# EAGLE design ECG_and_EMG_V2 (EAGLE 9.5.1)
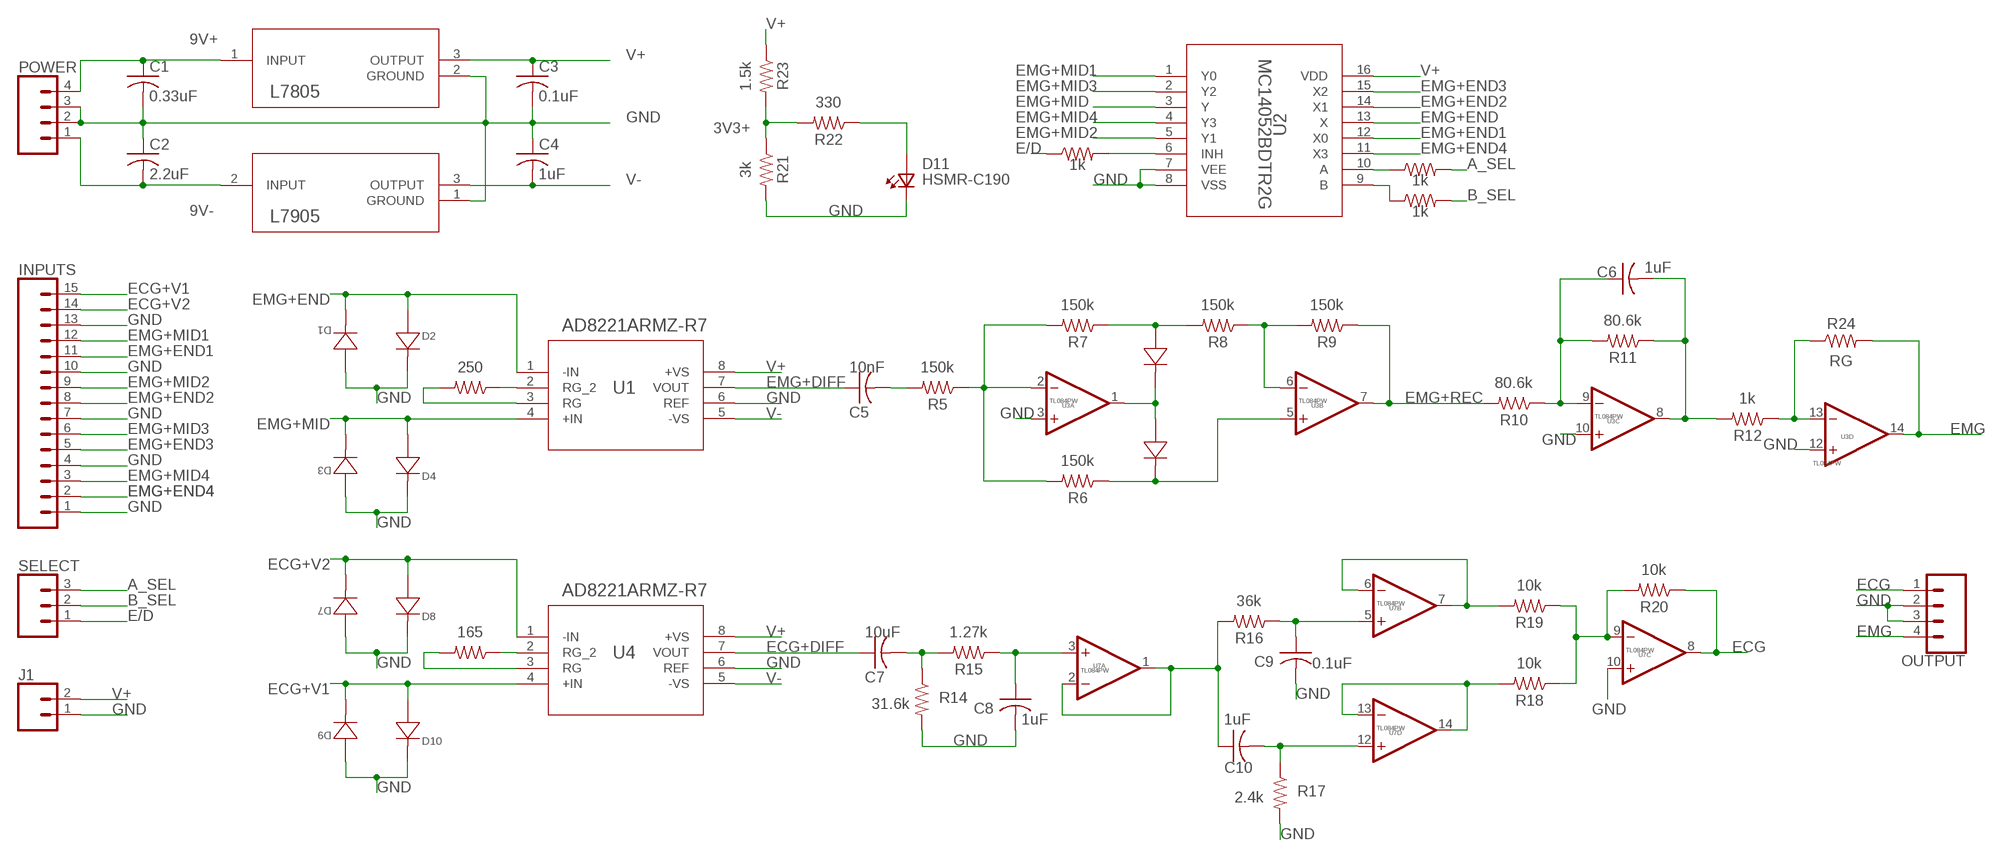
[diagram p0: schematic, sheet 1]

## Parts
C1  0.33uF  C-US_CHIP-0805(2012-METRIC)  [CAPC2012X110]
C2  2.2uF  C-US_CHIP-0805(2012-METRIC)  [CAPC2012X110]
C3  0.1uF  C-US_CHIP-0805(2012-METRIC)  [CAPC2012X110]
C4  1uF  C-US_CHIP-0805(2012-METRIC)  [CAPC2012X110]
C5  10nF  C-US_CHIP-0805(2012-METRIC)  [CAPC2012X110]
C6  1uF  C-US_CHIP-0805(2012-METRIC)  [CAPC2012X110]
C7  10uF  C-US_CHIP-0805(2012-METRIC)  [CAPC2012X110]
C8  1uF  C-US_CHIP-0805(2012-METRIC)  [CAPC2012X110]
C9  0.1uF  C-US_CHIP-0805(2012-METRIC)  [CAPC2012X110]
C10  1uF  C-US_CHIP-0805(2012-METRIC)  [CAPC2012X110]
D1  1N4148W-V-GS08SOD123_VIS-L  [SOD123_VIS-L]
D2  1N4148W-V-GS08SOD123_VIS-L  [SOD123_VIS-L]
D3  1N4148W-V-GS08SOD123_VIS-L  [SOD123_VIS-L]
D4  1N4148W-V-GS08SOD123_VIS-L  [SOD123_VIS-L]
D5  1N4148W-V-GS08SOD123_VIS-L  [SOD123_VIS-L]
D6  1N4148W-V-GS08SOD123_VIS-L  [SOD123_VIS-L]
D7  1N4148W-V-GS08SOD123_VIS-L  [SOD123_VIS-L]
D8  1N4148W-V-GS08SOD123_VIS-L  [SOD123_VIS-L]
D9  1N4148W-V-GS08SOD123_VIS-L  [SOD123_VIS-L]
D10  1N4148W-V-GS08SOD123_VIS-L  [SOD123_VIS-L]
D11  HSMR-C190  [0603]
INPUTS  CONN_15  [1X15]
J1  CONN_02  [1X02]
L7805  L7805CD2T-TRD2PAK_STM-M  [D2PAK_STM-M]
L7905  L7905ACD2T-TRD2PAK_STM-M  [D2PAK_STM-M]
OUTPUT  CONN_04  [1X04]
POWER  CONN_04  [1X04]
R1  1k  R-US_CHIP-0805(2012-METRIC)  [RESC2012X65]
R2  1k  R-US_CHIP-0805(2012-METRIC)  [RESC2012X65]
R3  1k  R-US_CHIP-0805(2012-METRIC)  [RESC2012X65]
R4  250  R-US_CHIP-0805(2012-METRIC)  [RESC2012X65]
R5  150k  R-US_CHIP-0805(2012-METRIC)  [RESC2012X65]
R6  150k  R-US_CHIP-0805(2012-METRIC)  [RESC2012X65]
R7  150k  R-US_CHIP-0805(2012-METRIC)  [RESC2012X65]
R8  150k  R-US_CHIP-0805(2012-METRIC)  [RESC2012X65]
R9  150k  R-US_CHIP-0805(2012-METRIC)  [RESC2012X65]
R10  80.6k  R-US_CHIP-0805(2012-METRIC)  [RESC2012X65]
R11  80.6k  R-US_CHIP-0805(2012-METRIC)  [RESC2012X65]
R12  1k  R-US_CHIP-0805(2012-METRIC)  [RESC2012X65]
R13  165  R-US_CHIP-0805(2012-METRIC)  [RESC2012X65]
R14  31.6k  R-US_CHIP-0805(2012-METRIC)  [RESC2012X65]
R15  1.27k  R-US_CHIP-0805(2012-METRIC)  [RESC2012X65]
R16  36k  R-US_CHIP-0805(2012-METRIC)  [RESC2012X65]
R17  2.4k  R-US_CHIP-0805(2012-METRIC)  [RESC2012X65]
R18  10k  R-US_CHIP-0805(2012-METRIC)  [RESC2012X65]
R19  10k  R-US_CHIP-0805(2012-METRIC)  [RESC2012X65]
R20  10k  R-US_CHIP-0805(2012-METRIC)  [RESC2012X65]
R21  3k  R-US_CHIP-0805(2012-METRIC)  [RESC2012X65]
R22  330  R-US_CHIP-0805(2012-METRIC)  [RESC2012X65]
R23  1.5k  R-US_CHIP-0805(2012-METRIC)  [RESC2012X65]
R24  RG  R-US_CHIP-0805(2012-METRIC)  [RESC2012X65]
SELECT  CONN_03  [1X03]
U1  AD8221ARMZ-R7  [RM_8_ADI]
U2  MC14052BDTR2G  [TSSOP-16_ONS]
U3  TL084PW  [TSSOP14]
U4  AD8221ARMZ-R7  [RM_8_ADI]
U7  TL084PW  [TSSOP14]

## Nets
3V3+ [Supply]: R21.1 R22.2 R23.2
9V+ [Supply]: C1.1 L7805.1(INPUT) POWER.4
9V- [Supply]: C2.2 L7905.2(INPUT) POWER.1
A_SEL: R2.2 SELECT.3
B_SEL: R3.2 SELECT.2
E/D: R1.1 SELECT.1
ECG: OUTPUT.1 R20.1 U7.8(C:OUT)
ECG+DIFF: C7.1 U4.7(VOUT)
ECG+V1: D9.1 D10.2 INPUTS.15 U4.4(+IN)
ECG+V2: D7.1 D8.2 INPUTS.14 U4.1(-IN)
EMG: OUTPUT.4 R24.2 U3.14(D:OUT)
EMG+DIFF: C5.1 U1.7(VOUT)
EMG+END: D1.1 D2.2 U1.1(-IN) U2.13(X)
EMG+END1: INPUTS.11 U2.12(X0)
EMG+END2: INPUTS.8 U2.14(X1)
EMG+END3: INPUTS.5 U2.15(X2)
EMG+END4: INPUTS.2 U2.11(X3)
EMG+MID: D3.1 D4.2 U1.4(+IN) U2.3(Y)
EMG+MID1: INPUTS.12 U2.1(Y0)
EMG+MID2: INPUTS.9 U2.5(Y1)
EMG+MID3: INPUTS.6 U2.2(Y2)
EMG+MID4: INPUTS.3 U2.4(Y3)
EMG+REC: R9.1 R10.2 U3.7(B:OUT)
GND [Supply]: C1.2 C2.1 C3.2 C4.1 C8.2 C9.2 D1.2 D2.1 D3.2 D4.1 D7.2 D8.1 D9.2 D10.1 D11.1(K2) INPUTS.1 INPUTS.4 INPUTS.7 INPUTS.10 INPUTS.13 J1.1 L7805.2(GROUND) L7905.1(GROUND) OUTPUT.2 OUTPUT.3 POWER.2 POWER.3 R14.2 R17.2 R21.2 U1.6(REF) U2.7(VEE) U2.8(VSS) U3.3(A:+IN) U3.10(C:+IN) U3.12(D:+IN) U4.6(REF) U7.10(C:+IN)
N$1: R1.2 U2.6(INH)
N$2: R2.1 U2.10(A)
N$3: R3.1 U2.9(B)
N$4: R4.1 U1.2(RG_2)
N$5: R4.2 U1.3(RG)
N$6: C5.2 R5.2
N$7: R5.1 R6.2 R7.2 U3.2(A:-IN)
N$8: D6.1 R6.1 U3.5(B:+IN)
N$9: D5.1 D6.2 U3.1(A:OUT)
N$10: D5.2 R7.1 R8.2
N$11: R8.1 R9.2 U3.6(B:-IN)
N$12: C6.1 R10.1 R11.2 U3.9(C:-IN)
N$13: C6.2 R11.1 R12.2 U3.8(C:OUT)
N$15: R13.1 U4.2(RG_2)
N$16: R12.1 R24.1 U3.13(D:-IN)
N$17: R13.2 U4.3(RG)
N$20: C7.2 R14.1 R15.2
N$21: C8.1 R15.1 U7.3(A:+IN)
N$22: C10.1 R16.2 U7.1(A:OUT) U7.2(A:-IN)
N$23: C9.1 R16.1 U7.5(B:+IN)
N$24: C10.2 R17.1 U7.12(D:+IN)
N$25: R18.2 U7.13(D:-IN) U7.14(D:OUT)
N$26: R19.2 U7.6(B:-IN) U7.7(B:OUT)
N$27: R18.1 R19.1 R20.2 U7.9(C:-IN)
N$28: D11.2(A2) R22.1
V+ [Supply]: C3.1 J1.2 L7805.3(OUTPUT) R23.1 U1.8(+VS) U2.16(VDD) U4.8(+VS)
V- [Supply]: C4.2 L7905.3(OUTPUT) U1.5(-VS) U4.5(-VS)

## Power pins joined to a net without a drawn wire
V+: U3.4(P:V+) U7.4(P:V+)
V-: U3.11(P:V-) U7.11(P:V-)

## Library data of the parts
C1-C10 = Capacitor:C-US: Capacitor - ANSI; CATEGORY: Capacitor
D1-D10 = 1N4148W (SOD123):1N4148W-V-GS08; BUILT_BY: EMA_UL_Team; MANUFACTURER_PART_NUMBER: 1N4148W-V-GS08; SOURCELIBRARY: Vishay_2020-02-10; VENDOR: Vishay
D11 = HSMR-C190:HSMR-C190: http://octopart.com/hsmr-c190-avago-672386; AVAILABILITY: Unavailable; DESCRIPTION: Blue 473nm LED Indication - Discrete 3.4V 0603 (1608 Metric); MF: Broadcom Limited; MP: HSMR-C190; PACKAGE: 0603 Broadcom; PRICE: None
INPUTS = SparkFun-Connectors:CONN_15: Multi connection point. Often used as Generic Header-pin footprint for 0.1 inch spaced/style header connections On any of the 0.1 inch spaced packages, you can populate with these: Break Away Headers - Straight <https://www.sparkfun.com/products/116> (PRT-00116) Break Away Male Headers - Right Angle <https://www.sparkfun.com/products/553> (PRT-00553) Female Headers <https://www.sparkfun.com/products/115> (PRT-00115) Break Away Headers - Machine Pin <https://www.sparkfun.com/products/117> (PRT-00117) Break Away Female Headers - Swiss Machine Pin <https://www.sparkfun.com/products/743> (PRT-00743) For SCREWTERMINALS and SPRING TERMINALS visit here: Screw Terimnals on SparkFun.com <https://www.sparkfun.com/search/results?term=Screw+Terminals> (5mm/3.5mm/2.54mm spacing) This device is also useful as a general connection point to wire up your design to another part of your project. Our various solder wires solder well into these plated through hole pads. Hook-Up Wire - Assortment (Stranded, 22 AWG) <https://www.sparkfun.com/products/11375> (PRT-11375) Hook-Up Wire - Assortment (Solid Core, 22 AWG) <https://www.sparkfun.com/products/11367> (PRT-11367) View the entire wire category on our website here <https://www.sparkfun.com/categories/141> Special notes: Molex polarized connector foot print use with SKU : PRT-08231 with associated crimp pins and housings. 1MM SMD Version SKU: PRT-10208 NOTES ON THE VARIANTS LOCK and LOCK_LONGPADS... This footprint was designed to help hold the alignment of a through-hole component (i.e. 6-pin header) while soldering it into place. You may notice that each hole has been shifted either up or down by 0.005 of an inch from it's more standard position (which is a perfectly straight line). This slight alteration caused the pins (the squares in the middle) to touch the edges of the holes. Because they are alternating, it causes a "brace" to hold the component in place. 0.005 has proven to be the perfect amount of "off-center" position when using our standard breakaway headers. Although looks a little odd when you look at the bare footprint, once you have a header in there, the alteration is very hard to notice. Also,if you push a header all the way into place, it is covered up entirely on the bottom side.
J1 = SparkFun-Connectors:CONN_02: Multi connection point. Often used as Generic Header-pin footprint for 0.1 inch spaced/style header connections On any of the 0.1 inch spaced packages, you can populate with these: Break Away Headers - Straight <https://www.sparkfun.com/products/116> (PRT-00116) Break Away Male Headers - Right Angle <https://www.sparkfun.com/products/553> (PRT-00553) Female Headers <https://www.sparkfun.com/products/115> (PRT-00115) Break Away Headers - Machine Pin <https://www.sparkfun.com/products/117> (PRT-00117) Break Away Female Headers - Swiss Machine Pin <https://www.sparkfun.com/products/743> (PRT-00743) For SCREWTERMINALS and SPRING TERMINALS visit here: Screw Terimnals on SparkFun.com <https://www.sparkfun.com/search/results?term=Screw+Terminals> (5mm/3.5mm/2.54mm spacing) This device is also useful as a general connection point to wire up your design to another part of your project. Our various solder wires solder well into these plated through hole pads. Hook-Up Wire - Assortment (Stranded, 22 AWG) <https://www.sparkfun.com/products/11375> (PRT-11375) Hook-Up Wire - Assortment (Solid Core, 22 AWG) <https://www.sparkfun.com/products/11367> (PRT-11367) View the entire wire category on our website here <https://www.sparkfun.com/categories/141> Special notes: Molex polarized connector foot print use with: PRT-08233 with associated crimp pins and housings. 2.54_SCREWTERM for use with PRT-10571. 3.5mm Screw Terminal footprints for PRT-08084 5mm Screw Terminal footprints for use with PRT-08432
L7805 = L7805 (D2PAK):L7805CD2T-TR; BUILT_BY: EMA_UL_Team; MANUFACTURER_PART_NUMBER: L7805CD2T-TR; SOURCELIBRARY: StMicro_2011-06-07; VENDOR: STMicroelectronics
L7905 = L7905 (D2PAK):L7905ACD2T-TR; BUILT_BY: EMA_UL_Team; MANUFACTURER_PART_NUMBER: L7905ACD2T-TR; SOURCELIBRARY: StMicro_2011-06-07; VENDOR: STMicroelectronics
OUTPUT POWER = SparkFun-Connectors:CONN_04: Multi connection point. Often used as Generic Header-pin footprint for 0.1 inch spaced/style header connections On any of the 0.1 inch spaced packages, you can populate with these: Break Away Headers - Straight <https://www.sparkfun.com/products/116> (PRT-00116) Break Away Male Headers - Right Angle <https://www.sparkfun.com/products/553> (PRT-00553) Female Headers <https://www.sparkfun.com/products/115> (PRT-00115) Break Away Headers - Machine Pin <https://www.sparkfun.com/products/117> (PRT-00117) Break Away Female Headers - Swiss Machine Pin <https://www.sparkfun.com/products/743> (PRT-00743) For SCREWTERMINALS and SPRING TERMINALS visit here: Screw Terimnals on SparkFun.com <https://www.sparkfun.com/search/results?term=Screw+Terminals> (5mm/3.5mm/2.54mm spacing) This device is also useful as a general connection point to wire up your design to another part of your project. Our various solder wires solder well into these plated through hole pads. Hook-Up Wire - Assortment (Stranded, 22 AWG) <https://www.sparkfun.com/products/11375> (PRT-11375) Hook-Up Wire - Assortment (Solid Core, 22 AWG) <https://www.sparkfun.com/products/11367> (PRT-11367) View the entire wire category on our website here <https://www.sparkfun.com/categories/141> Special notes: Molex polarized connector foot print use with SKU : PRT-08231 with associated crimp pins and housings. 1MM SMD Version SKU: PRT-10208; PROD_ID: CONN-09696
R1-R24 = Resistor:R-US: Resistor Fixed - ANSI; CATEGORY: Resistor; SUB-CATEGORY: Fixed
SELECT = SparkFun-Connectors:CONN_03: Multi connection point. Often used as Generic Header-pin footprint for 0.1 inch spaced/style header connections On any of the 0.1 inch spaced packages, you can populate with these: Break Away Headers - Straight <https://www.sparkfun.com/products/116> (PRT-00116) Break Away Male Headers - Right Angle <https://www.sparkfun.com/products/553> (PRT-00553) Female Headers <https://www.sparkfun.com/products/115> (PRT-00115) Break Away Headers - Machine Pin <https://www.sparkfun.com/products/117> (PRT-00117) Break Away Female Headers - Swiss Machine Pin <https://www.sparkfun.com/products/743> (PRT-00743) Stackable Header - 3 Pin (Female, 0.1") <https://www.sparkfun.com/products/13875> (PRT-13875) For SCREWTERMINALS and SPRING TERMINALS visit here: Screw Terimnals on SparkFun.com <https://www.sparkfun.com/search/results?term=Screw+Terminals> (5mm/3.5mm/2.54mm spacing) This device is also useful as a general connection point to wire up your design to another part of your project. Our various solder wires solder well into these plated through hole pads. Hook-Up Wire - Assortment (Stranded, 22 AWG) <https://www.sparkfun.com/products/11375> (PRT-11375) Hook-Up Wire - Assortment (Solid Core, 22 AWG) <https://www.sparkfun.com/products/11367> (PRT-11367) View the entire wire category on our website here <https://www.sparkfun.com/categories/141> Special notes: Molex polarized connector foot print use with SKU : PRT-08232 with associated crimp pins and housings.
U1 U4 = AD8221(8MSOP):AD8221ARMZ-R7; BUILT_BY: EMA_UL_Team; MANUFACTURER_PART_NUMBER: AD8221ARMZ-R7; SOURCELIBRARY: Analog_2012-01-01_5; VENDOR: Analog Devices Inc
U2 = MC14052 (16TSSOP):MC14052BDTR2G; COPYRIGHT: Copyright (C) 2016 Accelerated Designs. All rights reserved; MANUFACTURER_PART_NUMBER: MC14052BDTR2G; SOURCELIBRARY: ONSemi_2017-12-12_1; VENDOR: ON Semiconductor
U3 U7 = op-amp2:TL084: JFET OP-AMP - Quad

## Net classes
1 Supply: width 0.254 mm

## Board
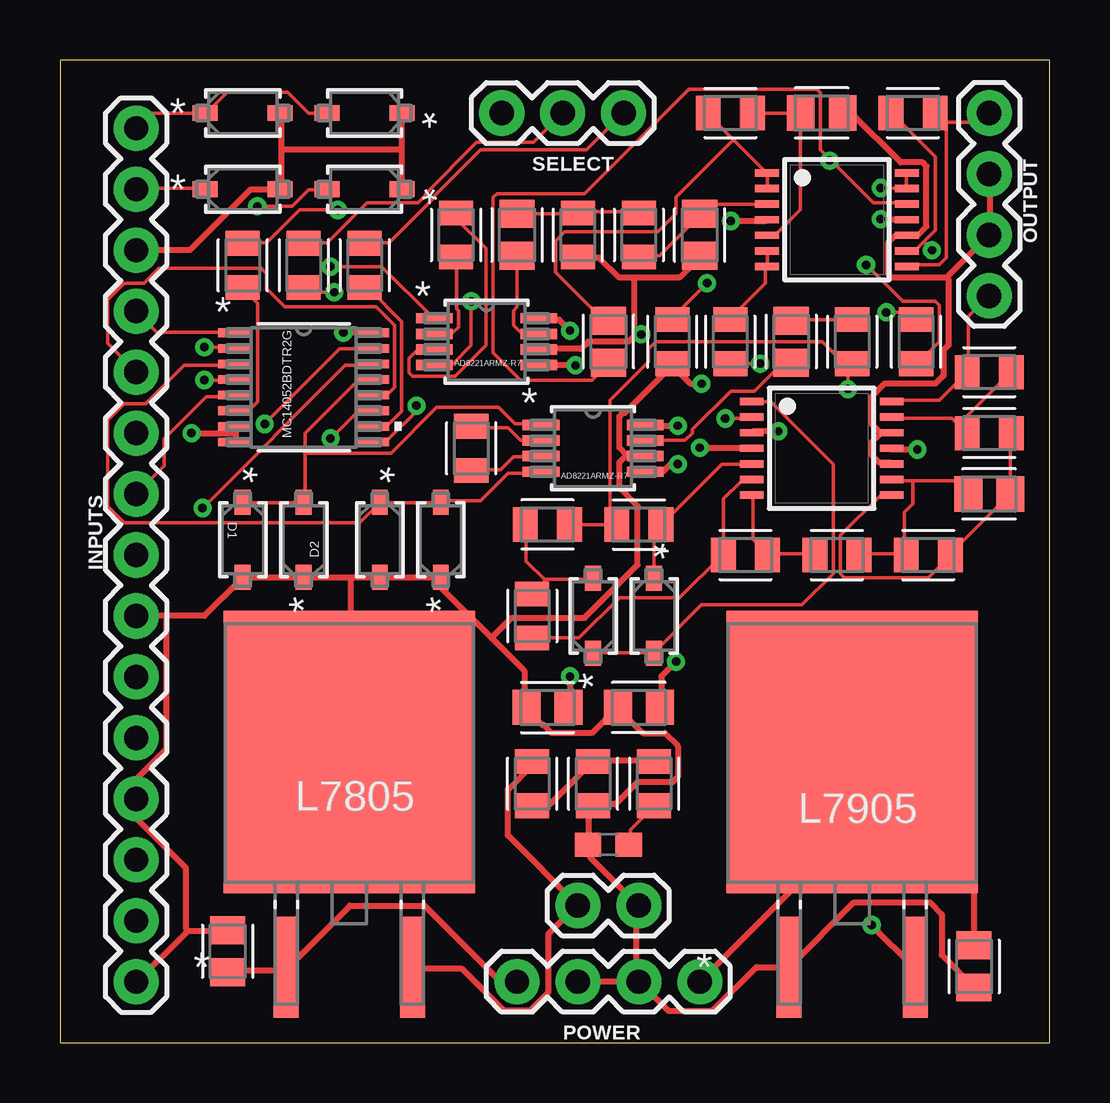
[diagram p1: board, top side]
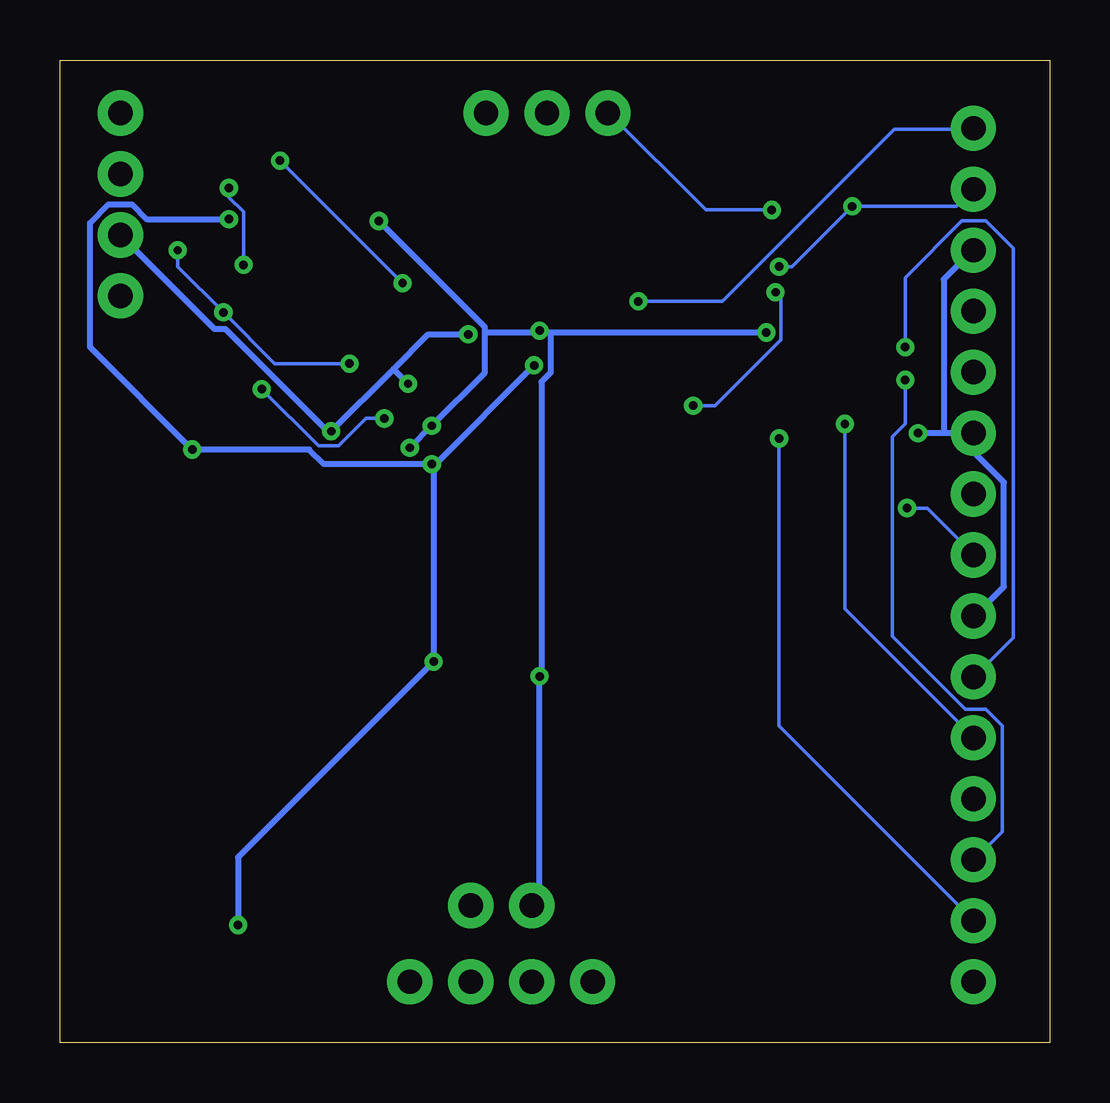
[diagram p2: board, bottom side, seen from below]

Size 41.26 x 40.95 mm. Coordinates in mm from the lower left corner, seen from the top.
Outline: 0,0 41.26,0 41.26,40.95 0,40.95 0,0
Copper layers (1*16): Top 0.035mm / dielectric 1.5mm / Bottom 0.035mm
Design rules "default": minimum track width 6mil, minimum drill 0.35mm, track to track 6mil, track to pad 6mil, pad to pad 6mil, via to via 6mil, smd to smd 6mil, copper to edge 40mil, drill to drill 6mil, minimum pad ring 10mil, minimum via ring 8mil, stop-mask expansion 4mil, vias tented up to drill 0mil, thermal gap 10mil

### Footprints (pad centres in the part's own frame; a part is rotated, then mirrored left to right if it is on the bottom)
CAPC2012X110 = smd 1.165 x 1.465: 1 -0.875,0; 2 0.875,0
SOD123_VIS-L = smd 1.041 x 0.66: 1 -1.562,0; 2 1.562,0
0603 = smd 1.1 x 1: 1 -0.85,0; 2 0.85,0
1X15 = drill 1.016 pad 1.88: 1 0,0; 2 2.54,0; 3 5.08,0; 4 7.62,0; 5 10.16,0; 6 12.7,0; 7 15.24,0; 8 17.78,0; 9 20.32,0; 10 22.86,0; 11 25.4,0; 12 27.94,0; 13 30.48,0; 14 33.02,0; 15 35.56,0
1X02 = drill 1.016 pad 1.88: 1 0,0; 2 2.54,0
D2PAK_STM-M = smd 1.041 x 4.216: 1 -2.64,-8.928; 3 2.64,-8.928 | smd 10.49 x 11.76: 2 0,0.051
1X04 = drill 1.016 pad 1.88: 1 0,0; 2 2.54,0; 3 5.08,0; 4 7.62,0
RESC2012X65 = smd 1.031 x 1.42: 1 -0.919,0; 2 0.919,0
1X03 = drill 1.016 pad 1.88: 1 0,0; 2 2.54,0; 3 5.08,0
RM_8_ADI = smd 1.524 x 0.432: 1 -2.172,0.975; 2 -2.172,0.325; 3 -2.172,-0.325; 4 -2.172,-0.975; 5 2.172,-0.975; 6 2.172,-0.325; 7 2.172,0.325; 8 2.172,0.975
TSSOP-16_ONS = smd 1.359 x 0.356: 1 -2.877,2.275; 2 -2.877,1.625; 3 -2.877,0.975; 4 -2.877,0.325; 5 -2.877,-0.325; 6 -2.877,-0.975; 7 -2.877,-1.625; 8 -2.877,-2.275; 9 2.877,-2.275; 10 2.877,-1.625; 11 2.877,-0.975; 12 2.877,-0.325; 13 2.877,0.325; 14 2.877,0.975; 15 2.877,1.625; 16 2.877,2.275
TSSOP14 = smd 0.305 x 0.991: 1 -1.95,-2.918; 2 -1.3,-2.918; 3 -0.65,-2.918; 4 0,-2.918; 5 0.65,-2.918; 6 1.3,-2.918; 7 1.95,-2.918; 8 1.95,2.918; 9 1.3,2.918; 10 0.65,2.918; 11 0,2.918; 12 -0.65,2.918; 13 -1.3,2.918; 14 -1.95,2.918

### Placement (x,y rotation side)
C1  6.99,3.81 90 top
C2  38.1,3.18 90 top
C3  20.32,13.97 180 top
C4  24.13,13.97 0 top
C5  30.48,29.21 90 top
C6  38.73,22.86 0 top
C7  19.05,33.66 90 top
C8  26.67,33.66 270 top
C9  31.75,38.73 0 top
C10  22.86,29.21 270 top
D1  7.62,20.95 270 top
D2  10.16,20.95 90 top
D3  13.34,20.95 270 top
D4  15.88,20.95 90 top
D5  22.23,17.78 90 top
D6  24.77,17.78 270 top
D7  7.62,35.56 0 top
D8  12.7,35.56 180 top
D9  7.62,38.73 0 top
D10  12.7,38.73 180 top
D11  22.86,8.25 0 top
INPUTS  3.17,2.54 90 top
J1  24.13,5.71 180 top
L7805  12.06,12.06 0 top
L7905  33.02,12.06 0 top
OUTPUT  38.73,38.73 270 top
POWER  26.67,2.54 180 top
R1  7.62,32.38 270 top
R2  12.7,32.38 90 top
R3  10.16,32.38 90 top
R4  17.14,24.77 270 top
R5  33.02,29.21 90 top
R6  24.13,21.59 180 top
R7  20.32,21.59 0 top
R8  19.68,17.78 90 top
R9  28.57,20.32 180 top
R10  32.38,20.32 180 top
R11  36.2,20.32 180 top
R12  38.73,25.4 0 top
R13  16.51,33.66 90 top
R14  21.59,33.66 270 top
R15  24.13,33.66 90 top
R16  27.94,38.73 180 top
R17  25.53,29.21 270 top
R18  35.69,29.21 270 top
R19  27.94,29.21 90 top
R20  35.56,38.73 180 top
R21  22.23,10.79 270 top
R22  24.77,10.79 90 top
R23  19.68,10.79 270 top
R24  38.73,27.94 180 top
SELECT  18.41,38.73 0 top
U1  22.23,24.77 0 top
U2  10.16,27.3 0 top
U3  31.75,24.77 270 top
U4  17.78,29.21 0 top
U7  32.38,34.29 270 top

### Tracks (layer width: path | path; a pad name or v marks a point on that pad's centre or on a via)
3V3+
  Top 0.254: R23.2 19.74,9.93 20.42,9.93 22.17,11.68 R21.1 22.33,11.76 24.77,11.76 R22.2
9V+
  Top 0.254: C1.1 7.01,3 9.3,3 9.37,3.07 L7805.1 9.53,3.15 12.09,5.71 15.19,5.71 18.36,2.54 POWER.4
9V-
  Top 0.254: C2.2 38.1,7.04 L7905.2 34.59,10.46 POWER.1
A_SEL
  Top 0.152: R2.2 12.72,33.33 13.72,33.33 15.54,35.15 15.54,35.23 17.53,37.21 21.95,37.21 23.47,38.73 SELECT.3
B_SEL
  Top 0.152: SELECT.2 19.74,37.52 17.37,37.52 15.24,35.38 15.24,35.31 14.94,35 12.8,35 11.12,33.33 10.21,33.33 R3.2
E/D  (via drill 0.35)
  Top 0.152: v11.58,34.7 9.98,34.7 8.61,33.33 7.62,33.33 R1.1
  Bottom 0.152: v11.58,34.7 14.33,34.7 18.36,38.73 SELECT.1
ECG
  Top 0.152: U7.8 35.36,32.41 36.65,32.41 36.96,32.72 36.96,38.28 36.5,38.73 R20.1 36.96,38.35 38.33,38.35 38.71,38.73 OUTPUT.1
ECG+DIFF
  Top 0.152: C7.1 19.05,30.66 18.9,30.5 18.9,29.9 19.2,29.59 19.89,29.59 U4.7
ECG+V1  (via drill 0.35)
  Top 0.152: INPUTS.15 3.81,38.73 D9.1 6.1,38.73 6.96,39.6 9.5,39.6 10.36,38.73 D10.2 | v17.14,30.89 17.14,29.06 16.38,28.3 15.62,28.3 U4.4
  Bottom 0.152: v17.14,30.89 13.64,30.89 6.48,38.05 3.2,38.05 INPUTS.15
ECG+V2  (via drill 0.35)
  Top 0.152: D7.1 6.02,35.61 3.2,35.61 INPUTS.14 | v8.23,34.85 9.68,34.85 10.36,35.53 11.12,35.53 D8.2 | v11.28,32.33 13.41,32.33 15.54,30.2 U4.1
  Bottom 0.152: INPUTS.14 3.89,34.85 v8.23,34.85 10.74,32.33 v11.28,32.33
EMG
  Top 0.152: U3.14 34.67,26.77 36.65,26.77 37.8,27.91 R24.2 37.87,27.99 37.87,30.28 38.71,31.12 OUTPUT.4
EMG+DIFF
  Top 0.152: C5.1 30.48,28.3 30.1,28.3 28.96,27.15 27.96,27.15 26.36,25.55 26.36,25.4 26.06,25.09 24.46,25.09 U1.7
EMG+END
  Top 0.152: D1.1 7.62,22.5 10.13,22.5 D2.2 10.21,22.58 10.21,24.56 | 10.21,24.56 10.21,25.4 12.42,27.61 13.03,27.61 U2.13 | 10.21,24.56 13.79,24.56 15.7,26.47 18.29,26.47 18.97,25.78 20.04,25.78 U1.1
EMG+END1
  Top 0.152: INPUTS.11 1.98,29.13 1.98,30.96 2.67,31.65 3.5,31.65 4.12,32.26 8.38,32.26 8.61,32.03 8.61,31.42 9.37,30.66 13.18,30.66 13.95,29.9 13.95,27.3 13.64,27 13.11,27 U2.12
EMG+END2  (via drill 0.35)
  Top 0.152: v5.94,22.28 11.89,28.22 13.03,28.22 U2.14
  Bottom 0.152: v5.94,22.28 5.11,22.28 3.2,20.37 INPUTS.8
EMG+END3  (via drill 0.35)
  Top 0.152: v8.53,25.78 11.66,28.91 13.03,28.91 U2.15
  Bottom 0.152: v8.53,25.78 8.53,18.09 3.2,12.75 INPUTS.5
EMG+END4  (via drill 0.35)
  Top 0.152: v11.28,25.17 12.42,26.31 13.03,26.31 U2.11
  Bottom 0.152: v11.28,25.17 11.28,13.21 3.2,5.13 INPUTS.2
EMG+MID
  Top 0.152: 13.34,22.5 15.85,22.5 D4.2 15.93,22.58 17.53,22.58 18.67,23.72 20.04,23.72 U1.4 | 13.34,22.5 12.5,21.67 2.67,21.67 1.98,22.35 1.98,25.93 2.67,26.62 3.58,26.62 5.18,28.22 7.24,28.22 U2.3 | 13.34,22.5 D3.1
EMG+MID1
  Top 0.152: U2.1 7.24,29.59 4.04,29.59 3.2,30.43 INPUTS.12
EMG+MID2
  Top 0.152: INPUTS.9 4.34,24.03 4.34,25.17 6.1,26.92 7.24,26.92 U2.5
EMG+MID3  (via drill 0.35)
  Top 0.152: v6.02,28.98 7.24,28.98 U2.2
  Bottom 0.152: v6.02,28.98 6.02,31.88 3.66,34.24 2.67,34.24 1.52,33.1 1.52,16.87 3.12,15.27 INPUTS.6
EMG+MID4  (via drill 0.35)
  Top 0.152: v6.02,27.61 7.24,27.61 U2.4
  Bottom 0.152: v6.02,27.61 6.02,25.78 6.55,25.25 6.55,16.94 3.5,13.89 2.67,13.89 1.98,13.21 1.98,8.79 3.12,7.64 INPUTS.3
EMG+REC
  Top 0.152: U3.7 28.88,22.81 28.88,20.98 29.49,20.37 R9.1 29.57,20.37 31.39,20.37 R10.2
GND  (via drill 0.35)
  Top 0.254: 23.93,31.88 25.83,31.88 26.67,32.72 C8.2 | 23.93,31.88 23.32,31.88 22.48,32.72 21.64,32.72 R14.2 | 23.93,29.44 23.7,29.21 22.02,29.21 21.72,28.91 19.96,28.91 U4.6 | 23.93,31.88 23.93,29.44 | 34.21,25.4 33.83,25.02 33.83,24.49 34.14,24.18 34.59,24.18 U3.10 | 34.21,25.4 34.59,25.4 U3.12 | v29.95,25.48 28.88,25.48 U3.3 | 36.96,31.88 34.67,31.88 34.52,32.03 34.52,33.33 34.82,33.63 35.28,33.63 U7.10 35.43,33.63 35.74,33.63 36.12,34.01 36.12,36.52 35.97,36.68 35.05,36.68 32.99,38.73 C9.2 | 36.96,31.88 OUTPUT.3 38.79,33.71 38.79,36.14 OUTPUT.2 | 34.21,25.4 33.83,25.78 33.83,26.92 34.37,27.46 36.5,27.46 36.83,27.79 36.83,28.85 37.03,29.06 37.03,31.8 36.96,31.88 | v24.23,29.52 24,29.52 23.93,29.44 | C2.1 36.75,3.66 36.75,5.36 36.27,5.84 33.1,5.84 30.4,3.15 L7905.1 30.25,3.15 29.03,3.15 27.2,1.32 25.38,1.32 24.23,2.46 POWER.2 | POWER.2 POWER.3 | POWER.2 24,2.62 24,5.66 J1.1 24.08,5.74 22.1,7.72 22.1,8.18 D11.1 22.02,8.25 22.02,9.7 22.17,9.86 R21.2 22.33,9.93 23.16,9.93 24.08,10.85 25.53,10.85 25.76,11.07 25.76,12.37 25.22,12.9 24.31,12.9 23.32,13.89 C4.1 22.17,12.9 20.5,12.9 20.14,13.26 20.14,13.21 19.45,13.91 C3.2 19.36,14.05 19.36,15.49 17.98,16.87 | 7.32,25.4 7.32,25.63 U2.7 | 7.32,25.4 7.32,25.09 U2.8 | v5.49,25.4 7.32,25.4 | 9.22,37.21 9.22,38.73 D9.2 | 9.22,37.21 9.22,35.61 D7.2 9.07,35.53 7.92,35.53 5.41,33.02 INPUTS.13 | 14.25,37.21 D10.1 | 14.25,37.21 14.25,35.61 D8.1 | 14.25,37.21 9.22,37.21 | 5.33,4.67 6.93,4.67 C1.2 | 5.33,4.67 3.2,2.54 INPUTS.1 | 5.33,4.67 5.26,4.75 5.26,7.26 3.2,9.32 3.2,10.16 INPUTS.4 3.28,10.24 3.28,11.07 4.42,12.22 4.42,17.78
  Top 0.254: 23.62,24.49 23.32,24.79 23.32,26.09 23.47,26.24 23.55,26.24 25.53,28.22 R17.2 25.6,28.14 26.29,27.46 v26.75,27.46 | 23.62,24.49 24.38,24.49 U1.6 | 12.12,19.38 13.26,19.38 D3.2 15.85,19.38 D4.1 15.93,19.3 15.93,18.92 17.98,16.87 | 12.12,19.38 10.29,19.38 D2.1 10.13,19.38 D1.2 7.54,19.3 6.02,17.78 4.42,17.78 | 23.62,24.49 23.32,24.18 23.32,23.11 24.08,22.35 24.08,19.91 21.87,17.7 18.82,17.7 17.98,16.87 | 4.42,17.78 INPUTS.7 | 12.12,19.38 12.12,12.14 L7805.2
  Bottom 0.254: OUTPUT.3 34.82,29.74 34.37,29.74 30.1,25.48 v29.95,25.48 27.36,28.07 | v24.23,29.52 25.91,29.52 27.36,28.07 | 4.42,25.4 INPUTS.10 3.12,25.32 3.12,24.56 1.91,23.34 1.91,19 3.12,17.78 INPUTS.7 | 4.42,25.4 v5.49,25.4 | 4.42,25.4 4.42,31.8 3.2,33.02 INPUTS.13 | v26.75,27.46 27.36,28.07
N$1
  Top 0.152: U2.6 7.32,26.39 7.92,26.39 8.23,26.7 8.23,30.81 7.62,31.42 R1.2
N$2
  Top 0.152: U2.10 13.11,25.7 13.64,25.7 14.25,26.31 14.25,30.05 12.88,31.42 12.72,31.42 R2.1
N$3  (via drill 0.35)
  Top 0.152: v14.86,26.54 14.86,26.31 13.64,25.09 13.11,25.09 U2.9 | v11.43,31.27 10.36,31.27 10.21,31.42 R3.1
  Bottom 0.152: v14.86,26.54 13.95,26.54 11.2,29.29 11.2,31.04 v11.43,31.27
N$4
  Top 0.152: R4.1 17.14,25.63 18.67,25.63 19.2,25.09 U1.2
N$5
  Top 0.152: R4.2 17.14,23.88 18.36,23.88 18.9,24.41 20.04,24.41 U1.3
N$6
  Top 0.152: R5.2 32.99,30.12 30.48,30.12 C5.2
N$7  (via drill 0.35)
  Top 0.152: 22.94,21.59 R6.2 23.16,21.59 | 22.94,21.59 R7.2 | v27.74,26.01 28.8,26.01 U3.2 | v32.84,27.23 32.84,28.07 32.99,28.22 R5.1 32.84,28.14 31.77,29.21 24.84,29.21 24.54,28.91 24.54,28.37 22.94,26.77 22.94,21.59
  Bottom 0.152: v27.74,26.01 28.5,26.01 29.64,24.87 30.48,24.87 v32.84,27.23
N$8
  Top 0.152: U3.5 28.8,24.11 27.58,24.11 25.07,21.59 R6.1 24.99,21.59 24.77,21.36 D6.1
N$9
  Top 0.152: 24.77,16.26 26.75,18.24 30.94,18.24 32.23,19.53 32.23,24.11 29.64,26.7 28.88,26.7 U3.1 | 24.77,16.26 22.25,16.26 D5.1 | 24.77,16.26 D6.2
N$10
  Top 0.152: 20.23,19.27 19.74,18.77 R8.2 | 20.23,19.27 20.27,19.3 22.17,19.3 D5.2 | 20.23,19.27 19.43,20.07 19.43,21.59 R7.1
N$11
  Top 0.152: U3.6 28.8,23.42 28.42,23.42 27.66,22.66 27.66,20.37 R9.2 27.58,20.3 25.83,18.54 23.32,18.54 21.64,16.87 19.74,16.87 R8.1
N$12
  Top 0.152: R10.1 33.38,20.37 35.2,20.37 R11.2 35.2,20.45 35.2,22.1 35.56,22.45 35.56,23.42 | 35.56,23.42 37.26,23.42 37.8,22.88 C6.1 | 35.56,23.42 34.67,23.42 U3.9
N$13
  Top 0.152: R12.2 39.62,25.4 39.62,22.88 C6.2 39.55,22.81 37.11,20.37 R11.1 37.11,20.3 36.2,19.38 32.69,19.38 32.54,19.53 32.54,21.13 34.21,22.81 34.59,22.81 U3.8
N$15
  Top 0.152: R13.1 16.54,32.72 16.54,30.58 16.61,30.5 16.61,29.82 16.38,29.59 15.62,29.59 U4.2
N$16
  Top 0.152: U3.13 34.67,26.01 37.19,26.01 37.8,25.4 R12.1 37.49,25.78 39.62,27.91 R24.1
N$17
  Top 0.152: R13.2 16.54,34.54 16.54,34.31 17.75,33.1 17.75,29.06 16.46,27.76 14.71,27.76 14.55,27.91 14.55,28.52 14.86,28.83 15.54,28.83 U4.3
N$20
  Top 0.152: R15.2 24.08,34.62 21.64,34.62 R14.1 21.57,34.54 19.05,34.54 C7.2
N$21
  Top 0.152: U7.3 29.41,34.92 27.05,34.92 26.67,34.54 C8.1 26.67,34.47 24.99,32.79 24.16,32.79 R15.1
N$22
  Top 0.152: U7.2 29.49,35.61 29.49,36.22 U7.1 29.41,36.3 28.08,37.63 | 28.08,37.63 26.98,38.73 R16.2 | 28.08,37.63 25.68,35.23 25.68,34.54 24.92,33.78 21.03,33.78 20.65,33.4 20.65,32.11 22.63,30.12 22.86,30.12 C10.1
N$23
  Top 0.152: C9.1 30.86,34.7 29.87,33.71 29.49,33.71 U7.5 | C9.1 R16.1 | C9.1
N$24  (via drill 0.35)
  Top 0.152: 32.12,36.79 31.7,37.21 31.7,39.57 31.55,39.73 26.21,39.73 21.87,35.38 18.21,35.38 18.06,35.23 18.06,28.75 19.2,27.61 22.17,27.61 22.86,28.3 C10.2 | 32.12,36.79 33.91,35 35.28,35 U7.12 | v26.98,31.65 25.53,30.2 R17.1 | v32.08,36.75 32.12,36.79
  Bottom 0.152: v32.08,36.75 v26.98,31.65
N$25  (via drill 0.35)
  Top 0.152: U7.14 35.28,36.22 35.28,35.61 U7.13 35.2,35.61 v34.21,35.61 | v33.6,32.41 35.13,30.89 36.5,30.89 36.65,30.73 36.65,29.21 35.74,28.3 R18.2
  Bottom 0.152: v34.21,35.61 34.21,35.23 33.6,34.62 v33.6,32.41
N$26
  Top 0.152: U7.6 29.49,32.94 29.49,32.41 U7.7 29.41,32.33 29.41,31.65 27.96,30.2 R19.2
N$27  (via drill 0.35)
  Top 0.152: 36.01,33.36 36.5,33.86 36.5,36.91 34.67,38.73 R20.2 | 36.01,33.36 35.66,33.02 35.36,33.02 U7.9 | v29.18,28.3 27.96,28.3 R19.1 | v34.44,30.43 35.43,30.43 35.66,30.2 R18.1 | v36.35,33.02 36.01,33.36
  Bottom 0.152: v29.18,28.3 32.31,28.3 v34.44,30.43 36.35,32.33 v36.35,33.02
N$28
  Top 0.152: D11.2 23.77,8.25 23.77,8.87 24.77,9.86 R22.1
V+  (via drill 0.35)
  Top 0.254: R23.1 19.66,11.68 19.66,11.53 18.67,10.54 18.67,8.64 J1.2 21.49,5.66 20.34,4.52 20.34,2.08 19.58,1.32 18.52,1.32 16.76,3.07 14.71,3.07 L7805.3 | v21.26,15.27 21.26,13.97 C3.1 | v26.67,24.79 28.8,24.79 U3.4 | v25.76,25.7 24.46,25.7 U1.8 | v27.96,34.24 29.41,34.24 U7.4 | v11.81,29.59 U2.16 | v21.26,29.67 20.8,30.12 19.96,30.12 U4.8
  Bottom 0.254: J1.2 21.26,6.04 v21.26,15.27 21.18,15.34 21.18,27.53 20.8,27.91 20.8,29.59 | v26.67,24.79 v25.76,25.7 23.55,27.91 23.55,29.59 | v27.96,34.24 23.55,29.82 23.55,29.59 | 23.55,29.59 21.26,29.59 | 21.26,29.59 20.8,29.59 | 20.8,29.59 v11.81,29.59 | v21.26,29.67 21.26,29.59
V-  (via drill 0.35)
  Top 0.254: v35.74,24.71 34.67,24.71 U3.11 | v25.76,24.11 25.45,24.11 25.15,23.8 24.46,23.8 U1.5 | v34.21,34.31 35.28,34.31 U7.11 | v25.68,15.88 25.07,15.27 25.07,13.97 C4.2 | v21.49,28.22 19.96,28.22 U4.5 | v33.83,4.9 35.59,3.15 L7905.3
  Bottom 0.254: v25.76,24.11 30.25,24.11 30.86,24.71 v35.74,24.71 40.01,28.98 40.01,34.16 39.24,34.92 38.25,34.92 37.64,34.31 v34.21,34.31 | v25.76,24.11 25.68,24.03 v25.68,15.88 33.83,7.72 v33.83,4.9 | v21.49,28.22 25.6,24.11 v25.76,24.11